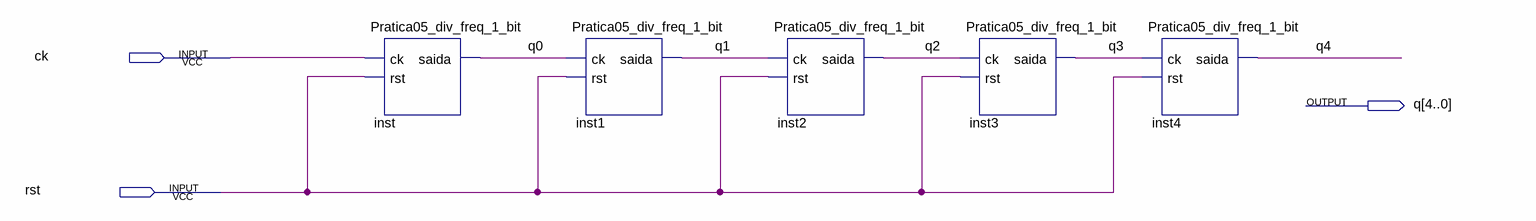
[diagram p0: schematic sheet]
// Quartus schematic Pratica05_div_freq_5_bits.bdf as structural Verilog: 5 symbols, 3 pins
module Pratica05_div_freq_5_bits (
  input  ck,
  input  rst,
  output [4:0] q
);

  Pratica05_div_freq_1_bit inst (.ck(ck), .rst(rst), .saida(q[0]));
  Pratica05_div_freq_1_bit inst1 (.ck(q[0]), .rst(rst), .saida(q[1]));
  Pratica05_div_freq_1_bit inst2 (.ck(q[1]), .rst(rst), .saida(q[2]));
  Pratica05_div_freq_1_bit inst3 (.ck(q[2]), .rst(rst), .saida(q[3]));
  Pratica05_div_freq_1_bit inst4 (.ck(q[3]), .rst(rst), .saida(q[4]));
endmodule
